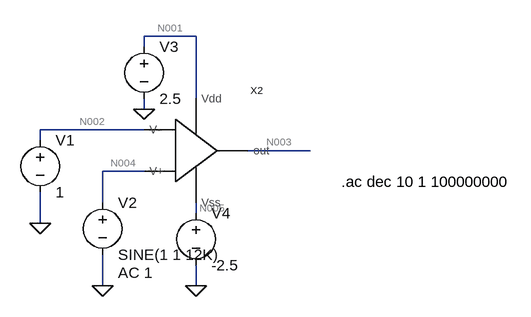
[diagram p0: schematic ac.asc]
ac.asc, the LTspice schematic file:
Version 4
SHEET 1 880 680
WIRE 224 -112 144 -112
WIRE 144 -96 144 -112
WIRE 224 -16 224 -112
WIRE 144 0 144 -16
WIRE 144 32 -16 32
WIRE -16 48 -16 32
WIRE 400 64 304 64
WIRE 144 96 80 96
WIRE 80 144 80 96
WIRE 224 160 224 144
WIRE -16 176 -16 128
WIRE 80 272 80 224
WIRE 224 272 224 240
FLAG -16 176 0
FLAG 80 272 0
FLAG 224 272 0
FLAG 144 0 0
SYMBOL voltage 144 -112 R0
WINDOW 123 0 0 Left 0
WINDOW 39 0 0 Left 0
SYMATTR InstName V3
SYMATTR Value 2.5
SYMBOL voltage -16 32 R0
WINDOW 123 0 0 Left 0
WINDOW 39 0 0 Left 0
SYMATTR InstName V1
SYMATTR Value 1
SYMBOL voltage 80 128 R0
WINDOW 123 24 124 Left 2
WINDOW 39 24 124 Left 2
SYMATTR Value2 AC 1
SYMATTR InstName V2
SYMATTR Value SINE(1 1 12K)
SYMBOL voltage 224 144 R0
WINDOW 123 0 0 Left 0
WINDOW 39 0 0 Left 0
SYMATTR InstName V4
SYMATTR Value -2.5
SYMBOL OPAMP 112 64 R0
SYMATTR InstName X2
TEXT 448 112 Left 2 !.ac dec 10 1 100000000

The netlist it stands for:
* ac.asc
V3 N001 0 2.5
V1 N002 0 1
V2 N004 0 SINE(1 1 12K) AC 1
V4 N005 0 -2.5
XX2 N001 N005 N002 N004 N003 OPAMP  ; pins Vdd Vss V- V+ out
.ac dec 10 1 100000000
.backanno
.end

* Results of the author's LTspice run, read from the files saved beside the schematic
* Operating Point, zero values left out:
*   V(n001) = 2.5 V
*   V(n002) = 1 V
*   V(n004) = 1 V
*   V(n005) = -2.5 V
*   V(n003) = 1.056 V
*   I(V3) = -194.5 µA
*   I(V4) = 194.5 µA
*   Ix(x2:VDD) = 194.5 µA
*   Ix(x2:VSS) = -194.5 µA
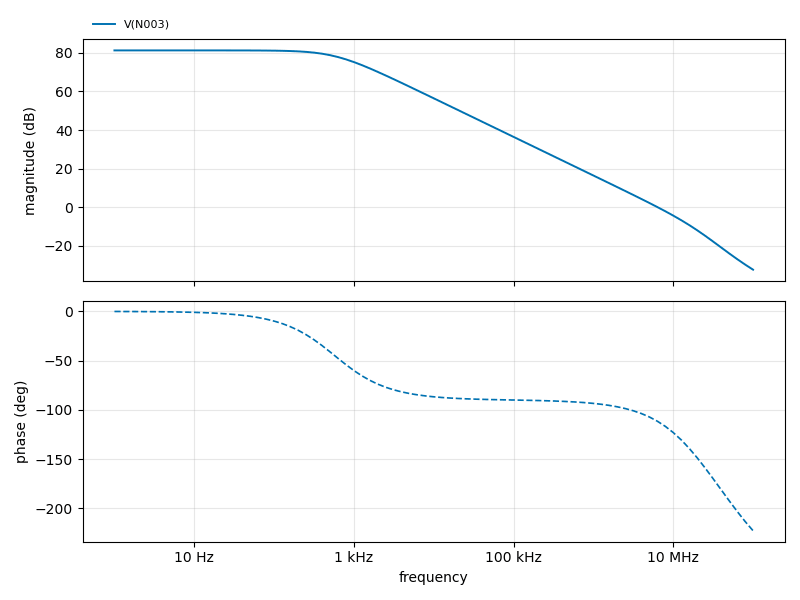
[diagram p1: AC Analysis of ac.asc, plotted from the saved traces]
* AC Analysis, 1 run:
*   V(N003): 81.28 dB at 1 Hz, -32.32 dB at 100 MHz, peak 81.28 dB at 1 Hz, 3 dB below the peak at 571.1 Hz